# EAGLE design MM_Capstone (EAGLE 9.3.1)
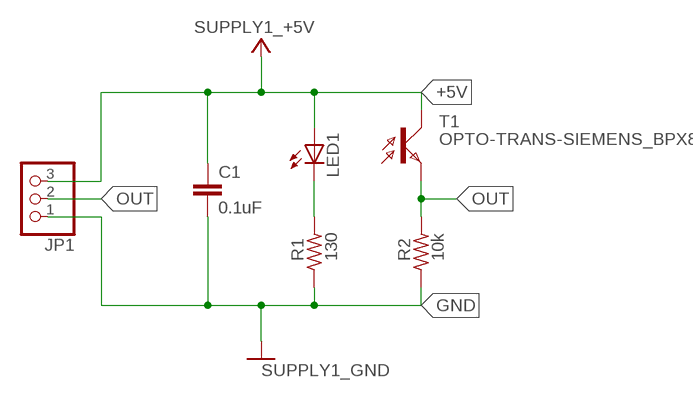
[diagram p0: schematic, sheet 1]

## Parts
C1  0.1uF  RCL_C-EUC1206  [RCL_C1206]
JP1  PINHEAD_PINHD-1X3  [PINHEAD_1X03]
LED1  LED_LED5MM  [LED_LED5MM]
R1  130  RCL_R-US_R1206  [RCL_R1206]
R2  10k  RCL_R-US_R1206  [RCL_R1206]
T1  OPTO-TRANS-SIEMENS_BPX81  [OPTO-TRANS-SIEMENS_BPX81]

## Nets
+5V: C1.1 JP1.3 LED1.A T1.C ; supply symbol labelled SUPPLY1_+5V
GND: C1.2 JP1.1 R1.1 R2.1 ; supply symbol labelled SUPPLY1_GND
N$1: LED1.K(C) R1.2
OUT: JP1.2 R2.2 T1.E

## Library data of the parts
C1 = IR_Sensor:RCL_C-EU: CAPACITOR, European symbol; SPICEPREFIX: C
JP1 = IR_Sensor:PINHEAD_PINHD-1X3: PIN HEADER
LED1 = IR_Sensor:LED_LED: LED OSRAM: - CHIPLED LG R971, LG N971, LY N971, LG Q971, LY Q971, LO R971, LY R971 LH N974, LH R974 LS Q976, LO Q976, LY Q976 LO Q996 - Hyper CHIPLED LW Q18S LB Q993, LB Q99A, LB R99A - SideLED LS A670, LO A670, LY A670, LG A670, LP A670 LB A673, LV A673, LT A673, LW A673 LH A674 LY A675 LS A676, LA A676, LO A676, LY A676, LW A676 LS A679, LY A679, LG A679 - Hyper Micro SIDELED® LS Y876, LA Y876, LO Y876, LY Y876 LT Y87S - SmartLED LW L88C, LW L88S LB L89C, LB L89S, LG L890 LS L89K, LO L89K, LY L89K LS L896, LA L896, LO L896, LY L896 - TOPLED LS T670, LO T670, LY T670, LG T670, LP T670 LSG T670, LSP T670, LSY T670, LOP T670, LYG T670 LG T671, LOG T671, LSG T671 LB T673, LV T673, LT T673, LW T673 LH T674 LS T676, LA T676, LO T676, LY T676, LB T676, LH T676, LSB T676, LW T676 LB T67C, LV T67C, LT T67C, LS T67K, LO T67K, LY T67K, LW E67C LS E67B, LA E67B, LO E67B, LY E67B, LB E67C, LV E67C, LT E67C LW T67C LS T679, LY T679, LG T679 LS T770, LO T770, LY T770, LG T770, LP T770 LB T773, LV T773, LT T773, LW T773 LH T774 LS E675, LA E675, LY E675, LS T675 LS T776, LA T776, LO T776, LY T776, LB T776 LHGB T686 LT T68C, LB T68C - Hyper Mini TOPLED® LB M676 - Mini TOPLED Santana® LG M470 LS M47K, LO M47K, LY M47K Source: http://www.osram.convergy.de LUXEON: - LUMILED® LXK2-PW12-R00, LXK2-PW12-S00, LXK2-PW14-U00, LXK2-PW14-V00 LXK2-PM12-R00, LXK2-PM12-S00, LXK2-PM14-U00 LXK2-PE12-Q00, LXK2-PE12-R00, LXK2-PE12-S00, LXK2-PE14-T00, LXK2-PE14-U00 LXK2-PB12-K00, LXK2-PB12-L00, LXK2-PB12-M00, LXK2-PB14-N00, LXK2-PB14-P00, LXK2-PB14-Q00 LXK2-PR12-L00, LXK2-PR12-M00, LXK2-PR14-Q00, LXK2-PR14-R00 LXK2-PD12-Q00, LXK2-PD12-R00, LXK2-PD12-S00 LXK2-PH12-R00, LXK2-PH12-S00 LXK2-PL12-P00, LXK2-PL12-Q00, LXK2-PL12-R00 Source: www.luxeon.com KINGBRIGHT: KA-3528ASYC Source: www.kingbright.com
R1 R2 = IR_Sensor:RCL_R-US_: RESISTOR, American symbol; SPICEPREFIX: R
T1 = IR_Sensor:OPTO-TRANS-SIEMENS_BPX81: PHOTO TRANSISTOR; OC_FARNELL: unknown; OC_NEWARK: unknown

## Board
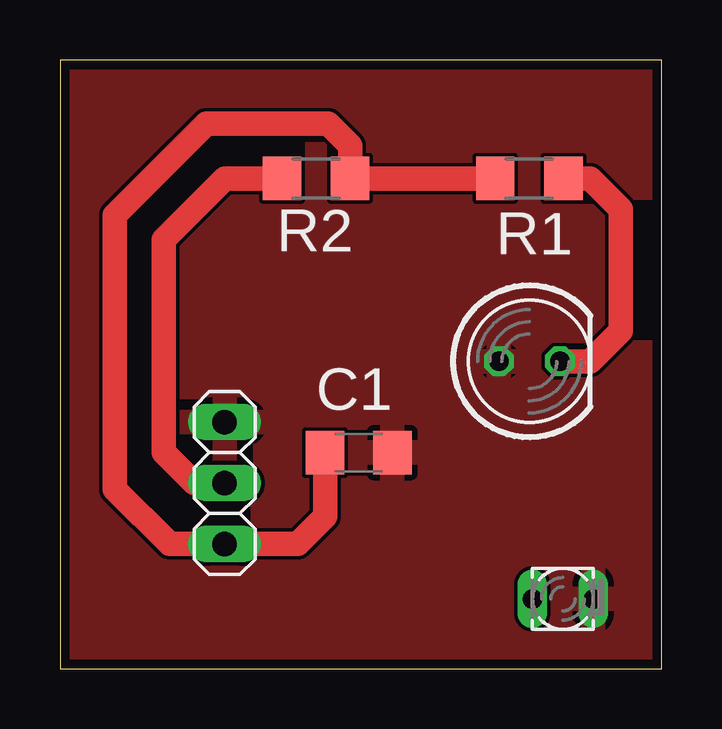
[diagram p1: board, top side]
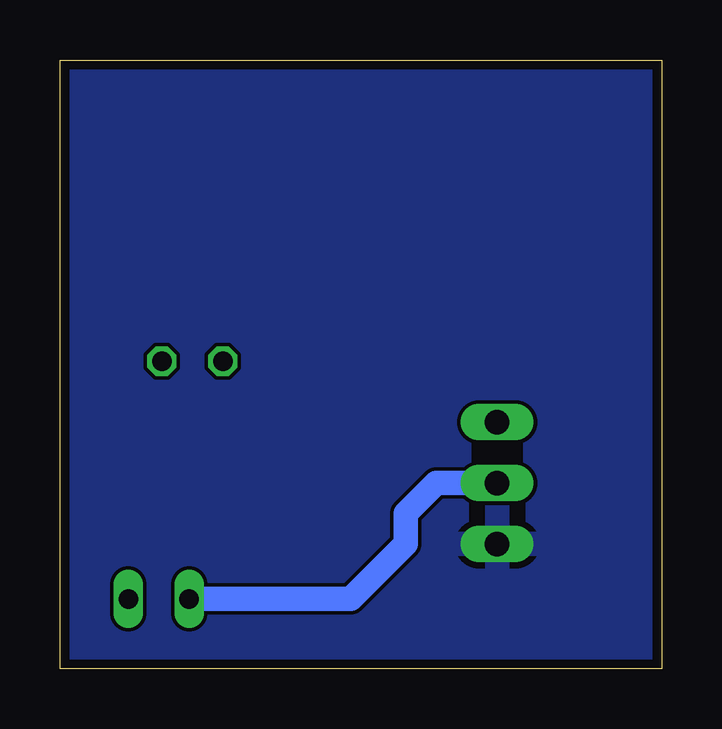
[diagram p2: board, bottom side, seen from below]

Size 25.07 x 25.39 mm. Coordinates in mm from the lower left corner, seen from the top.
Outline: 0,0 25.07,0 25.07,25.39 0,25.39 0,0
Copper layers (1*16): Top 0.035559375mm / dielectric 1.6mm / Bottom 0.035559375mm
Design rules "oshpark": minimum track width 6mil, minimum drill 10mil, track to track 6mil, track to pad 6mil, pad to pad 6mil, via to via 6mil, smd to smd 6mil, copper to edge 15mil, drill to drill 6mil, minimum pad ring 5mil, minimum via ring 5mil, stop-mask expansion 2.5mil, vias tented up to drill 0mil, thermal gap 10mil

### Footprints (pad centres in the part's own frame; a part is rotated, then mirrored left to right if it is on the bottom)
RCL_C1206 = smd 1.6 x 1.8: 1 -1.4,0; 2 1.4,0
PINHEAD_1X03 = drill 1.016 long: 1 -2.54,0; 2 0,0; 3 2.54,0
LED_LED5MM = drill 0.813 octagon: A -1.27,0; K 1.27,0
RCL_R1206 = smd 1.6 x 1.803: 1 -1.422,0; 2 1.422,0
OPTO-TRANS-SIEMENS_BPX81 = drill 0.813 long: C 1.27,0; E -1.27,0

### Placement (x,y rotation side)
C1  12.45,9.02 180 top
JP1  6.86,7.75 90 top
LED1  19.56,12.83 0 top
R1  19.56,20.45 0 top
R2  10.67,20.45 180 top
T1  20.95,2.92 0 top

### Tracks (layer width: path | path; a pad name or v marks a point on that pad's centre or on a via)
+5V
  pour Top: 0,25.4 25.4,25.4 25.4,0 0,0
GND
  Top 1.016: R1.1 R2.1 12.09,21.82 11.18,22.73 6.1,22.73 2.29,18.92 2.29,7.49 4.57,5.21 JP1.1 9.91,5.21 11.05,6.35 C1.2
  pour Bottom: 0,25.4 25.4,25.4 25.4,0 0,0
N$1
  Top 1.016: R1.2 22.1,20.45 23.37,19.18 23.37,14.1 22.1,12.83 LED1.K
OUT
  Top 1.016: JP1.2 5.59,7.75 4.32,9.02 4.32,17.91 6.86,20.45 R2.2
  Bottom 1.016: JP1.2 9.4,7.75 10.67,6.48 10.67,5.21 12.95,2.92 T1.E

### Text on the board
tPlace: R2 | R1 | C1